# EAGLE design Controller_Keinz_2023 (EAGLE 9.4.2)

## Sheet 1 of 3
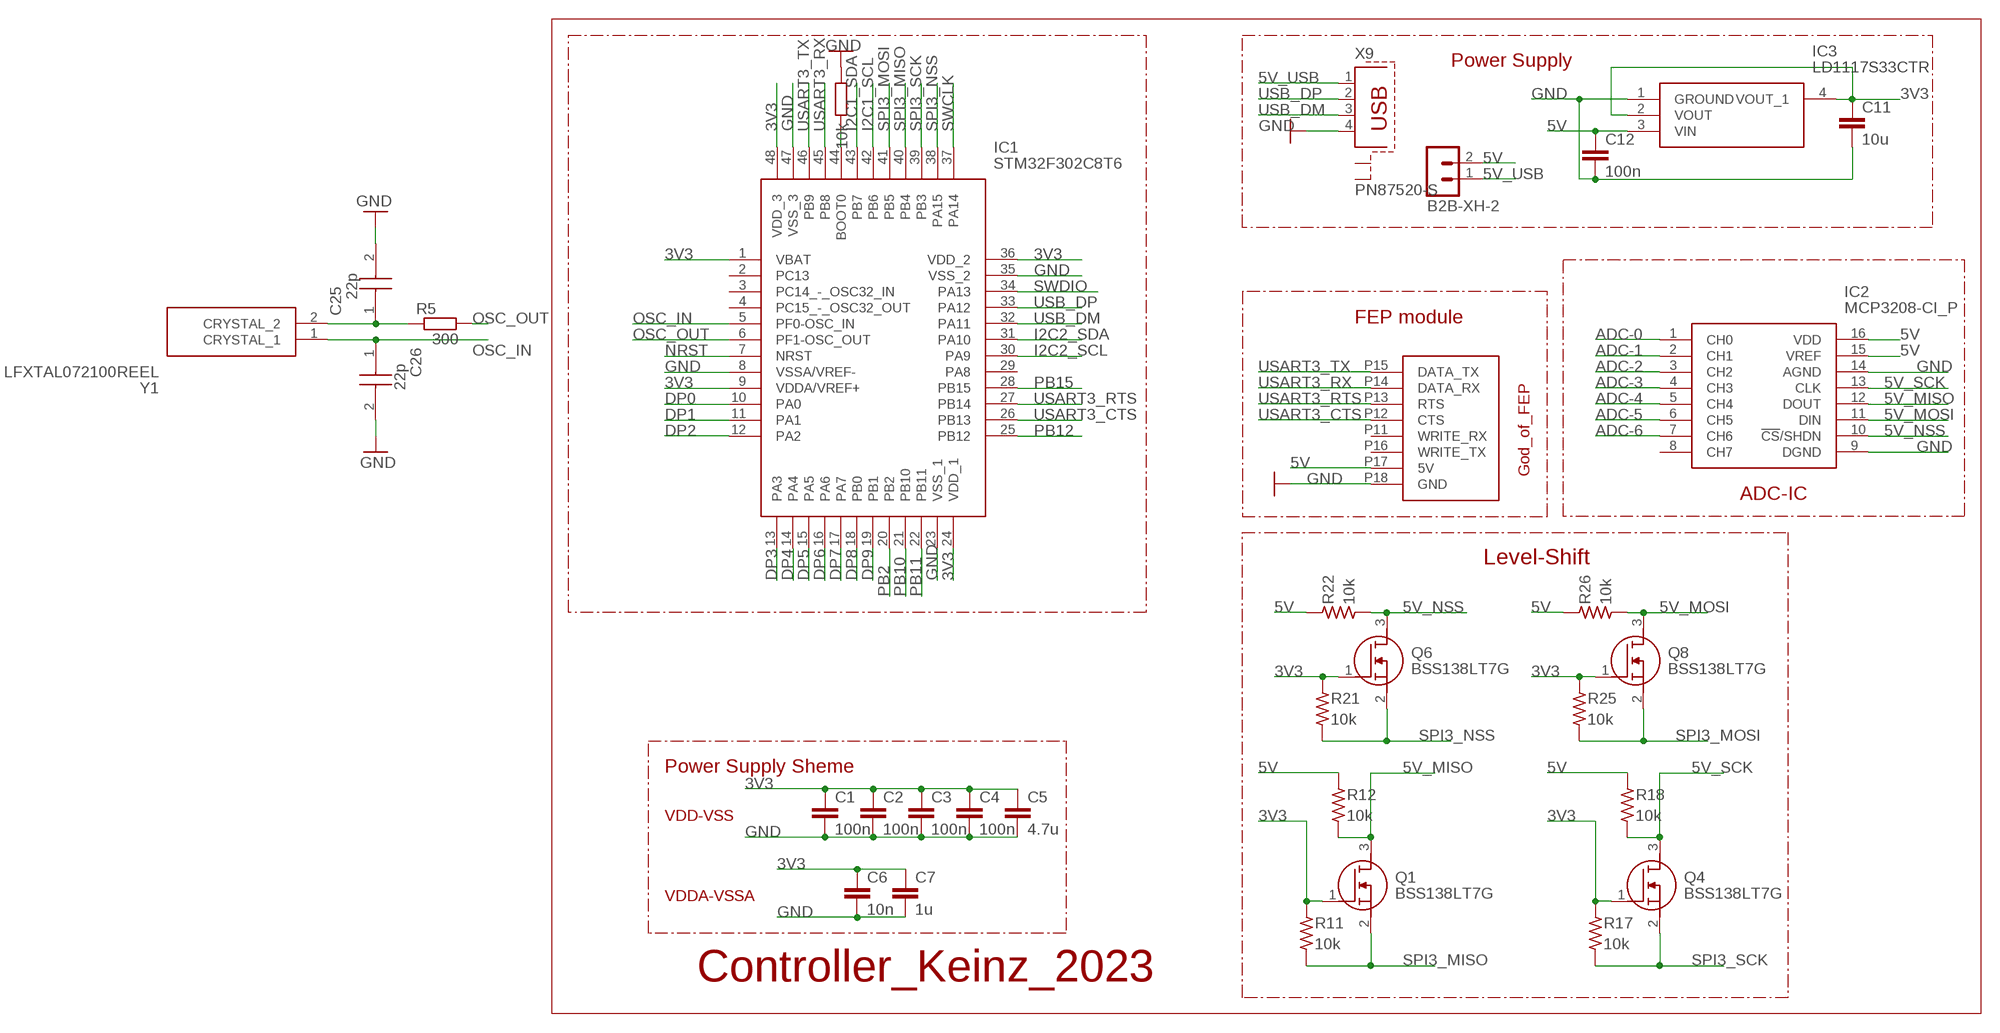
[diagram p0: schematic, sheet 1]

### Parts
C1  100n  C-EUC0603K  [C0603K]
C2  100n  C-EUC0603K  [C0603K]
C3  100n  C-EUC0603K  [C0603K]
C4  100n  C-EUC0603K  [C0603K]
C5  4.7u  C-EUC0603K  [C0603K]
C6  10n  C-EUC0603K  [C0603K]
C7  1u  C-EUC0603K  [C0603K]
C11  10u  C-EUC0603K  [C0603K]
C12  100n  C-EUC0603K  [C0603K]
C25  22p  AMK107BBJ476MA-RE  [CAPC1709X100N]
C26  22p  AMK107BBJ476MA-RE  [CAPC1709X100N]
FEP_1  GOD_OF_FEP  [GOD_OF_FEP]
IC1  STM32F302C8T6  [QFP50P900X900X160-48N]
IC2  MCP3208-CI_P  [DIP781W56P254L1918H533Q16N]
IC3  LD1117S33CTR  [SOT230P700X190-4N]
Q1  BSS138LT7G  [SOT96P237X111-3N]
Q4  BSS138LT7G  [SOT96P237X111-3N]
Q6  BSS138LT7G  [SOT96P237X111-3N]
Q8  BSS138LT7G  [SOT96P237X111-3N]
R5  300  R1608  [1608]
R8  10k  R-EU_R0603  [R0603]
R11  10k  RESISTOR-US1608  [SMD1608]
R12  10k  RESISTOR-US1608  [SMD1608]
R17  10k  RESISTOR-US1608  [SMD1608]
R18  10k  RESISTOR-US1608  [SMD1608]
R21  10k  RESISTOR-US1608  [SMD1608]
R22  10k  RESISTOR-US1608  [SMD1608]
R25  10k  RESISTOR-US1608  [SMD1608]
R26  10k  RESISTOR-US1608  [SMD1608]
X9  PN87520-S  [PN87520-S]
X22  B2B-XH-2  [B2B-XH-A]
Y1  LFXTAL072100REEL  [LFXTAL072100REEL]

### Nets
3V3: C1.1 C2.1 C3.1 C4.1 C5.1 C6.1 C7.1 C11.1 IC1.1(VBAT) IC1.9(VDDA/VREF+) IC1.24(VDD_1) IC1.36(VDD_2) IC1.48(VDD_3) IC3.2(VOUT) IC3.4(VOUT_1) Q1.1(G) Q4.1(G) Q6.1(G) Q8.1(G) R11.1 R17.1 R21.1 R25.1 ; also sheet 2,3
5V: C12.1 FEP_1.P17(5V) IC2.15(VREF) IC2.16(VDD) IC3.3(VIN) R12.1 R18.1 R22.1 R26.1 X22.2 ; also sheet 2,3
5V_MISO: IC2.12(DOUT) Q1.3(D) R12.2
5V_MOSI: IC2.11(DIN) Q8.3(D) R26.2
5V_NSS: IC2.10(!CS!/SHDN) Q6.3(D) R22.2
5V_SCK: IC2.13(CLK) Q4.3(D) R18.2
5V_USB: X9.1 X22.1
ADC-0: IC2.1(CH0) ; also sheet 2
ADC-1: IC2.2(CH1) ; also sheet 2
ADC-2: IC2.3(CH2) ; also sheet 2
ADC-3: IC2.4(CH3) ; also sheet 2
ADC-4: IC2.5(CH4) ; also sheet 2
ADC-5: IC2.6(CH5) ; also sheet 2
ADC-6: IC2.7(CH6) ; also sheet 2
DP0: IC1.10(PA0) ; also sheet 2
DP1: IC1.11(PA1) ; also sheet 2
DP2: IC1.12(PA2) ; also sheet 2
DP3: IC1.13(PA3) ; also sheet 2
DP4: IC1.14(PA4) ; also sheet 2
DP5: IC1.15(PA5) ; also sheet 2
DP6: IC1.16(PA6) ; also sheet 2
DP7: IC1.17(PA7) ; also sheet 2
DP8: IC1.18(PB0) ; also sheet 2
DP9: IC1.19(PB1) ; also sheet 2
GND: C1.2 C2.2 C3.2 C4.2 C5.2 C6.2 C7.2 C11.2 C12.2 C25.2 C26.2 FEP_1.P18(GND) IC1.8(VSSA/VREF-) IC1.23(VSS_1) IC1.35(VSS_2) IC1.47(VSS_3) IC2.9(DGND) IC2.14(AGND) IC3.1(GROUND) R8.1 X9.4 ; also sheet 2,3
I2C1_SCL: IC1.42(PB6) ; also sheet 2
I2C1_SDA: IC1.43(PB7) ; also sheet 2
I2C2_SCL: IC1.30(PA9) ; also sheet 2
I2C2_SDA: IC1.31(PA10) ; also sheet 2
N$20: C25.1 R5.1 Y1.2(CRYSTAL_2)
N$36: IC1.44(BOOT0) R8.2
NRST: IC1.7(NRST) ; also sheet 2
OSC_IN: C26.1 IC1.5(PF0-OSC_IN) Y1.1(CRYSTAL_1)
OSC_OUT: IC1.6(PF1-OSC_OUT) R5.2
PB2: IC1.20(PB2) ; also sheet 3
PB10: IC1.21(PB10) ; also sheet 3
PB11: IC1.22(PB11) ; also sheet 2
PB12: IC1.25(PB12) ; also sheet 3
PB15: IC1.28(PB15) ; also sheet 3
SPI3_MISO: IC1.40(PB4) Q1.2(S) R11.2
SPI3_MOSI: IC1.41(PB5) Q8.2(S) R25.2
SPI3_NSS: IC1.38(PA15) Q6.2(S) R21.2
SPI3_SCK: IC1.39(PB3) Q4.2(S) R17.2
SWCLK: IC1.37(PA14) ; also sheet 2
SWDIO: IC1.34(PA13) ; also sheet 2
USART3_CTS: FEP_1.P12(CTS) IC1.26(PB13)
USART3_RTS: FEP_1.P13(RTS) IC1.27(PB14)
USART3_RX: FEP_1.P14(DATA_RX) IC1.45(PB8)
USART3_TX: FEP_1.P15(DATA_TX) IC1.46(PB9)
USB_DM: IC1.32(PA11) X9.3
USB_DP: IC1.33(PA12) X9.2
Unconnected: FEP_1.P11(WRITE_RX) FEP_1.P16(WRITE_TX) IC1.2(PC13) IC1.3(PC14_-_OSC32_IN) IC1.4(PC15_-_OSC32_OUT) IC1.29(PA8) IC2.8(CH7) X9.S1 X9.S2

### Notes on the sheet
- Power Supply
- FEP module
- ADC-IC
- Level-Shift
- Power Supply Sheme
- VDD-VSS
- VDDA-VSSA
- Controller_Keinz_2023

## Sheet 2 of 3
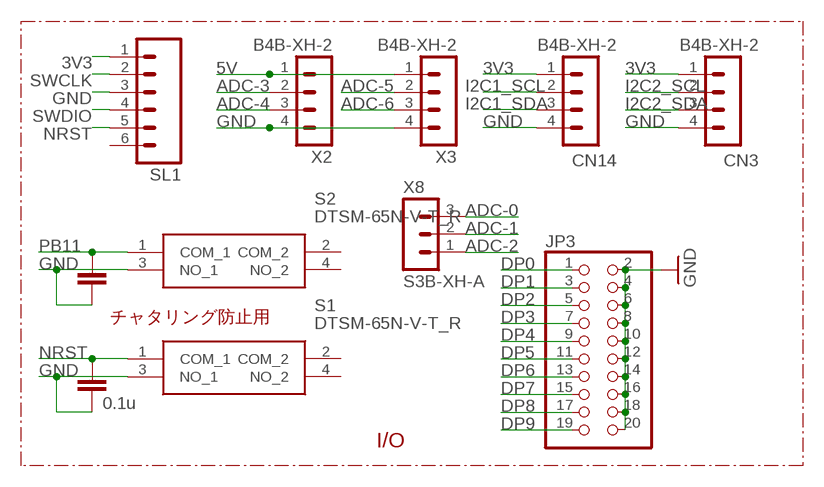
[diagram p1: schematic, sheet 2]

### Parts
C8  0.1u  C-EUC0603K  [C0603K]
C13  0.1u  C-EUC0603K  [C0603K]
CN3  B4B-XH-2  [B4B-XH-A]
CN14  B4B-XH-2  [B4B-XH-A]
JP3  PINHD-2X10  [2X10]
S1  DTSM-65N-V-T_R  [DTSM65NVTR]
S2  DTSM-65N-V-T_R  [DTSM65NVTR]
SL1  MA06  [06PA]
X2  B4B-XH-2  [B4B-XH-A]
X3  B4B-XH-2  [B4B-XH-A]
X8  S3B-XH-A  [S3B-XH-A]

### Nets
3V3: CN3.1 CN14.1 SL1.1 ; also sheet 1,3
5V: X2.1 X3.1 ; also sheet 1,3
ADC-0: X8.3 ; also sheet 1
ADC-1: X8.2 ; also sheet 1
ADC-2: X8.1 ; also sheet 1
ADC-3: X2.2 ; also sheet 1
ADC-4: X2.3 ; also sheet 1
ADC-5: X3.2 ; also sheet 1
ADC-6: X3.3 ; also sheet 1
DP0: JP3.1 ; also sheet 1
DP1: JP3.3 ; also sheet 1
DP2: JP3.5 ; also sheet 1
DP3: JP3.7 ; also sheet 1
DP4: JP3.9 ; also sheet 1
DP5: JP3.11 ; also sheet 1
DP6: JP3.13 ; also sheet 1
DP7: JP3.15 ; also sheet 1
DP8: JP3.17 ; also sheet 1
DP9: JP3.19 ; also sheet 1
GND: C8.2 C13.2 CN3.4 CN14.4 JP3.2 JP3.4 JP3.6 JP3.8 JP3.10 JP3.12 JP3.14 JP3.16 JP3.18 JP3.20 S1.3(NO_1) S2.3(NO_1) SL1.3 X2.4 X3.4 ; also sheet 1,3
I2C1_SCL: CN14.2 ; also sheet 1
I2C1_SDA: CN14.3 ; also sheet 1
I2C2_SCL: CN3.2 ; also sheet 1
I2C2_SDA: CN3.3 ; also sheet 1
NRST: C13.1 S1.1(COM_1) SL1.5 ; also sheet 1
PB11: C8.1 S2.1(COM_1) ; also sheet 1
SWCLK: SL1.2 ; also sheet 1
SWDIO: SL1.4 ; also sheet 1
Unconnected: S1.2(COM_2) S1.4(NO_2) S2.2(COM_2) S2.4(NO_2) SL1.6

### Notes on the sheet
- チャタリング防止用
- I/O

## Sheet 3 of 3
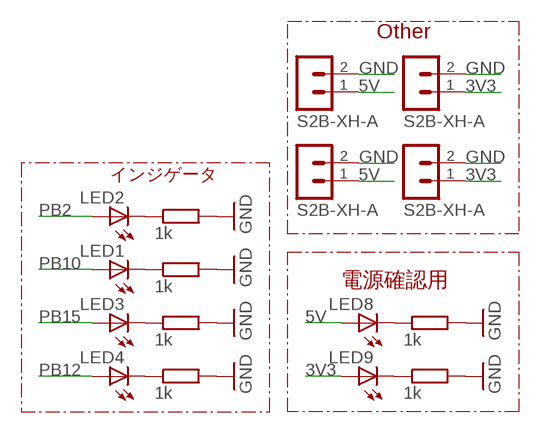
[diagram p2: schematic, sheet 3]

### Parts
LED1  LEDCHIP-LED0805  [CHIP-LED0805]
LED2  LEDCHIP-LED0805  [CHIP-LED0805]
LED3  LEDCHIP-LED0805  [CHIP-LED0805]
LED4  LEDCHIP-LED0805  [CHIP-LED0805]
LED8  LEDCHIP-LED0805  [CHIP-LED0805]
LED9  LEDCHIP-LED0805  [CHIP-LED0805]
R1  1k  R-EU_R0603  [R0603]
R2  1k  R-EU_R0603  [R0603]
R3  1k  R-EU_R0603  [R0603]
R4  1k  R-EU_R0603  [R0603]
R9  1k  R-EU_R0603  [R0603]
R10  1k  R-EU_R0603  [R0603]
X4  S2B-XH-A  [S2B-XH-A]
X5  S2B-XH-A  [S2B-XH-A]
X6  S2B-XH-A  [S2B-XH-A]
X7  S2B-XH-A  [S2B-XH-A]

### Nets
3V3: LED9.A X4.1 X5.1 ; also sheet 1,2
5V: LED8.A X6.1 X7.1 ; also sheet 1,2
GND: R1.2 R2.2 R3.2 R4.2 R9.2 R10.2 X4.2 X5.2 X6.2 X7.2 ; also sheet 1,2
N$1: LED2.C R1.1
N$2: LED1.C R2.1
N$3: LED3.C R3.1
N$4: LED4.C R4.1
N$9: LED9.C R10.1
N$10: LED8.C R9.1
PB2: LED2.A ; also sheet 1
PB10: LED1.A ; also sheet 1
PB12: LED4.A ; also sheet 1
PB15: LED3.A ; also sheet 1

### Notes on the sheet
- Other
- インジゲータ
- 電源確認用

## Library data of the parts
C1-C8 C11-C13 = rcl:C-EU: CAPACITOR, European symbol
C25 C26 = SamacSys_Parts:AMK107BBJ476MA-RE: 0603 (1608M) 47uF MLCC 4V dc +/-20% SMD Source: Datasheet <https://ds.yuden.co.jp/TYCOMPAS/ut/detail?pn=AMK107BBJ476MA-RE&u=M>; DESCRIPTION: 0603 (1608M) 47uF MLCC 4V dc +/-20% SMD; HEIGHT: 1mm; MANUFACTURER_NAME: TAIYO YUDEN; MANUFACTURER_PART_NUMBER: AMK107BBJ476MA-RE; MOUSER_PART_NUMBER: 963-AMK107BBJ476MARE; MOUSER_PRICE-STOCK: https://www.mouser.com/Search/Refine.aspx?Keyword=963-AMK107BBJ476MARE; RS_PART_NUMBER: 1843762P; RS_PRICE-STOCK: http://uk.rs-online.com/web/p/products/1843762P
CN3 CN14 X2 X3 = JST-XH:B4B-XH: JST XH series header 2.50mm pitch disconnectable crimp style connectors, vertical (side entry type), 4 pins
FEP_1 = God_of_FEP:GOD_OF_FEP
IC1 = SamacSys_Parts:STM32F302C8T6: STMICROELECTRONICS - STM32F302C8T6 - MCU, 32BIT, CORTEX-M4, 72MHZ, LQFP-48 Source: Datasheet <http://www.st.com/content/ccc/resource/technical/document/datasheet/e4/06/d5/04/58/af/41/14/DM00093333.pdf/files/DM00093333.pdf/jcr:content/translations/en.DM00093333.pdf>; ARROW_PART_NUMBER: STM32F302C8T6; ARROW_PRICE-STOCK: https://www.arrow.com/en/products/stm32f302c8t6/stmicroelectronics; DESCRIPTION: STMICROELECTRONICS - STM32F302C8T6 - MCU, 32BIT, CORTEX-M4, 72MHZ, LQFP-48; HEIGHT: 1.6mm; MANUFACTURER_NAME: STMicroelectronics; MANUFACTURER_PART_NUMBER: STM32F302C8T6; MOUSER_PART_NUMBER: 511-STM32F302C8T6; MOUSER_PRICE-STOCK: https://www.mouser.co.uk/ProductDetail/STMicroelectronics/STM32F302C8T6?qs=F5OEftmZcCDUtHR76ET77A%3D%3D
IC2 = SamacSys_Parts:MCP3208-CI_P: A/D Converters Source: Datasheet <https://eu.mouser.com/datasheet/2/268/21298e-1101808.pdf>; ARROW_PART_NUMBER: MCP3208-CI/P; ARROW_PRICE-STOCK: https://www.arrow.com/en/products/mcp3208-cip/microchip-technology?region=europe; DESCRIPTION: A/D Converters; HEIGHT: 5.334mm; MANUFACTURER_NAME: Microchip; MANUFACTURER_PART_NUMBER: MCP3208-CI/P; MOUSER_PART_NUMBER: 579-MCP3208CIP; MOUSER_PRICE-STOCK: https://www.mouser.co.uk/ProductDetail/Microchip-Technology/MCP3208-CI-P?qs=9y3LFqDLL8IuAGJEebQX9g%3D%3D
IC3 = SamacSys_Parts:LD1117S33CTR: LD1117S33CTR, Low Dropout Voltage Regulator, 1.3A, 3.3 V +/-1%, 4-Pin SOT-223 Source: Datasheet <http://www.st.com/st-web-ui/static/active/en/resource/technical/document/datasheet/CD00000544.pdf>; ALLIED_NUMBER: 70390200; ALLIED_PRICE-STOCK: http://www.alliedelec.com/stmicroelectronics-ld1117s33ctr/70390200/; DESCRIPTION: LD1117S33CTR, Low Dropout Voltage Regulator, 1.3A, 3.3 V +/-1%, 4-Pin SOT-223; HEIGHT: 1.9mm; MANUFACTURER_NAME: STMicroelectronics; MANUFACTURER_PART_NUMBER: LD1117S33CTR; MOUSER_PART_NUMBER: 511-LD1117S33C; MOUSER_PRICE-STOCK: https://www.mouser.com/Search/Refine.aspx?Keyword=511-LD1117S33C; RS_PART_NUMBER: 6869388P; RS_PRICE-STOCK: http://uk.rs-online.com/web/p/products/6869388P
JP3 = pinhead:PINHD-2X10: PIN HEADER
LED1-LED4 LED8 LED9 = adafruit:LED: LED OSRAM: - CHIPLED LG R971, LG N971, LY N971, LG Q971, LY Q971, LO R971, LY R971 LH N974, LH R974 LS Q976, LO Q976, LY Q976 LO Q996 - Hyper CHIPLED LW Q18S LB Q993, LB Q99A, LB R99A - SideLED LS A670, LO A670, LY A670, LG A670, LP A670 LB A673, LV A673, LT A673, LW A673 LH A674 LY A675 LS A676, LA A676, LO A676, LY A676, LW A676 LS A679, LY A679, LG A679 - Hyper Micro SIDELED® LS Y876, LA Y876, LO Y876, LY Y876 LT Y87S - SmartLED LW L88C, LW L88S LB L89C, LB L89S, LG L890 LS L89K, LO L89K, LY L89K LS L896, LA L896, LO L896, LY L896 - TOPLED LS T670, LO T670, LY T670, LG T670, LP T670 LSG T670, LSP T670, LSY T670, LOP T670, LYG T670 LG T671, LOG T671, LSG T671 LB T673, LV T673, LT T673, LW T673 LH T674 LS T676, LA T676, LO T676, LY T676, LB T676, LH T676, LSB T676, LW T676 LB T67C, LV T67C, LT T67C, LS T67K, LO T67K, LY T67K, LW E67C LS E67B, LA E67B, LO E67B, LY E67B, LB E67C, LV E67C, LT E67C LW T67C LS T679, LY T679, LG T679 LS T770, LO T770, LY T770, LG T770, LP T770 LB T773, LV T773, LT T773, LW T773 LH T774 LS E675, LA E675, LY E675, LS T675 LS T776, LA T776, LO T776, LY T776, LB T776 LHGB T686 LT T68C, LB T68C - Hyper Mini TOPLED® LB M676 - Mini TOPLED Santana® LG M470 LS M47K, LO M47K, LY M47K Source: http://www.osram.convergy.de/
Q1 Q4 Q6 Q8 = SamacSys_Parts:BSS138LT7G: MOSFET Single N-Channel Logic Level Power MOSFET 50V, 200mA, 3.5 Source: Datasheet <https://www.mouser.com/datasheet/2/308/BSS138LT1-D-1522521.pdf>; ARROW_PART_NUMBER: BSS138LT7G; ARROW_PRICE-STOCK: https://www.arrow.com/en/products/bss138lt7g/on-semiconductor; DESCRIPTION: MOSFET Single N-Channel Logic Level Power MOSFET 50V, 200mA, 3.5; HEIGHT: 1.11mm; MANUFACTURER_NAME: ON Semiconductor; MANUFACTURER_PART_NUMBER: BSS138LT7G; MOUSER_PART_NUMBER: 863-BSS138LT7G; MOUSER_PRICE-STOCK: https://www.mouser.co.uk/ProductDetail/ON-Semiconductor/BSS138LT7G/?qs=l7cgNqFNU1gVGpXKtqpwiw%3D%3D
R1-R4 R8-R10 = rcl:R-EU_: RESISTOR, European symbol; SPICEPREFIX: R
R5 = 1608:R1608
R11 R12 R17 R18 R21 R22 R25 R26 = generic:RESISTOR-US: Generic Registor
S1 S2 = SamacSys_Parts:DTSM-65N-V-T_R: Tactile Switches Surface Mounting Type 6*6 Source: Datasheet <https://componentsearchengine.com/Datasheets/1/DTSM-65N-V-T_R.pdf>; DESCRIPTION: Tactile Switches Surface Mounting Type 6*6; HEIGHT: 9.6mm; MANUFACTURER_NAME: Diptronics; MANUFACTURER_PART_NUMBER: DTSM-65N-V-T/R; MOUSER_PART_NUMBER: 113-DTSM-65N-V-T/R; MOUSER_PRICE-STOCK: https://www.mouser.com/Search/Refine.aspx?Keyword=113-DTSM-65N-V-T%2FR
SL1 = con-amp-quick:MA06: AMP QUICK CONNECTOR; OC_FARNELL: unknown; OC_NEWARK: unknown
X4-X7 = con-JST_XH:S2B-XH: JST XH series header 2.50mm pitch disconnectable crimp style connectors, horizontal (side entry type), 2 pins
X8 = con-JST_XH:S3B-XH: JST XH series header 2.50mm pitch disconnectable crimp style connectors, horizontal (side entry type), 3 pins
X9 = con-berg_improved_by_keinz:PN87520-S; OC_FARNELL: unknown; OC_NEWARK: unknown
X22 = con-JST_XH:B2B-XH: JST XH series header 2.50mm pitch disconnectable crimp style connectors, vertical (side entry type), 2 pins
Y1 = SamacSys_Parts:LFXTAL072100REEL: Industry standard SMD crystal/ HC49/4HSMX Source: Datasheet <https://www.mouser.de/datasheet/2/741/LFXTAL072100Reel-1001673.pdf>; DESCRIPTION: Industry standard SMD crystal/ HC49/4HSMX; HEIGHT: 4.3mm; MANUFACTURER_NAME: IQD; MANUFACTURER_PART_NUMBER: LFXTAL072100REEL

## Board
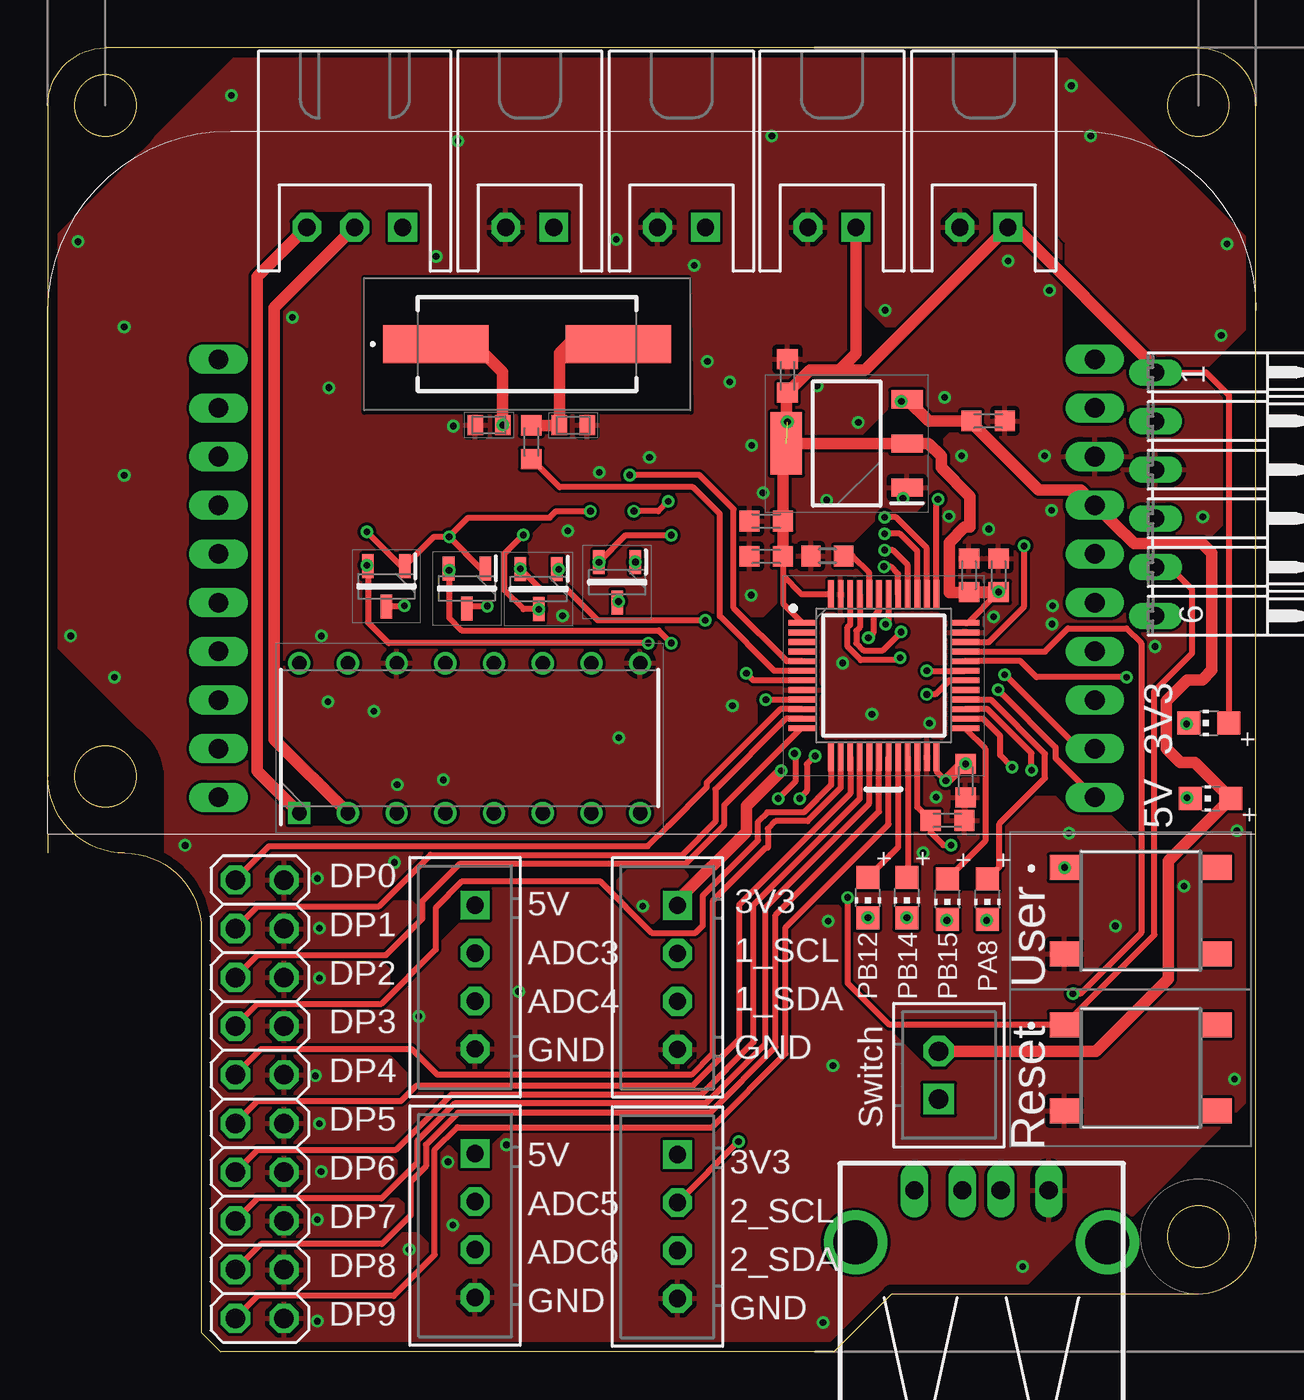
[diagram p3: board, top side]
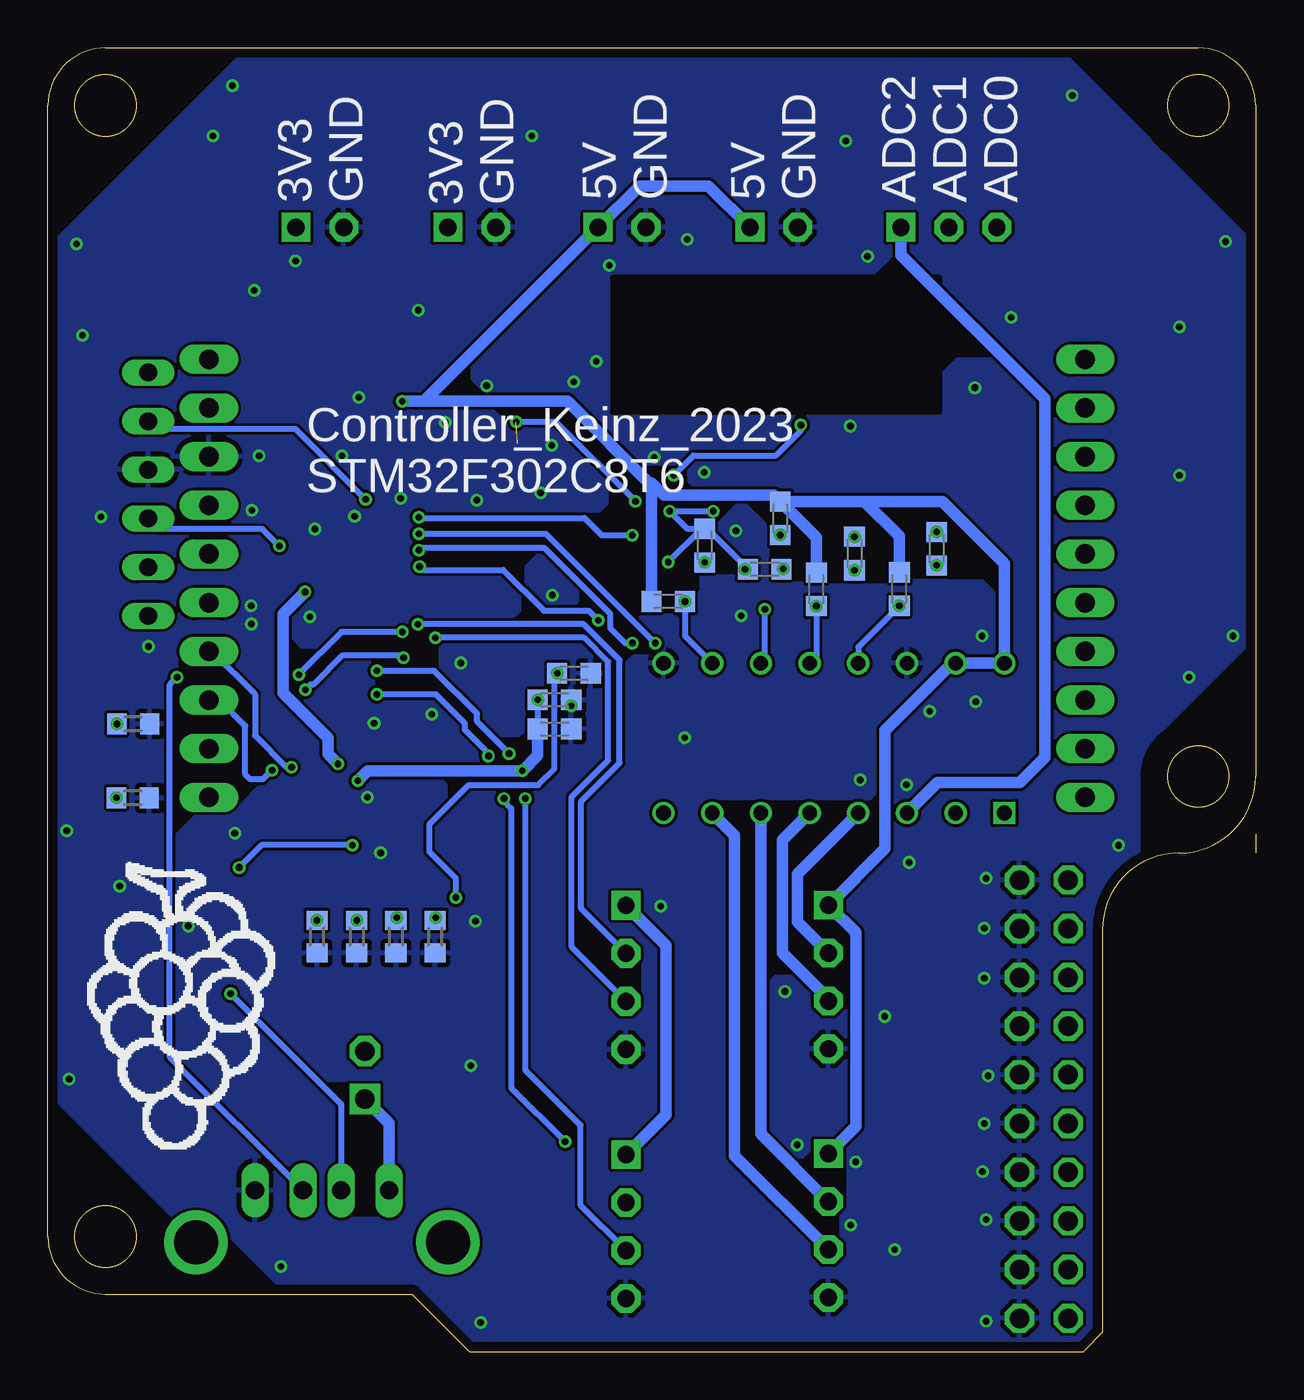
[diagram p4: board, bottom side, seen from below]

Size 63 x 68 mm. Coordinates in mm from the lower left corner, seen from the top.
Outline: 0,27 0,26
Outline: 63,6 63,65 arc90 60,68 3,68 arc90 0,65 0,30 arc90 4,26 arc-90 8,22 8,1 9,0 41,0 44,3 60,3 arc90 63,6
Outline: circle at 3,65 radius 1.6
Outline: circle at 60,65 radius 1.6
Outline: circle at 3,30 radius 1.6
Outline: circle at 60,6 radius 1.6
Copper layers (1*16): Top 0.035mm / dielectric 1.6mm / Bottom 0.035mm
Design rules "Elecrow_2-layer_PCB_eagle_rule": minimum track width 6mil, minimum drill 12mil, track to track 6mil, track to pad 6mil, pad to pad 6mil, via to via 8mil, smd to smd 0mil, copper to edge 20mil, drill to drill 10mil, minimum pad ring 6mil, minimum via ring 6mil, stop-mask expansion 0mil, vias tented up to drill 100mil, thermal gap 10mil
tRestrict: area 0,62 to 6,68; area 0,27 to 6,33; area 57,62 to 63,68; area 57,3 to 63,9; 78 lines
bRestrict: area 0,62 to 6,68; area 0,27 to 6,33; area 57,62 to 63,68; area 57,3 to 63,9; 79 lines
vRestrict: 1 lines

### Footprints (pad centres in the part's own frame; a part is rotated, then mirrored left to right if it is on the bottom)
C0603K = smd 1.05 x 1.08: 1 -0.875,0; 2 0.875,0
CAPC1709X100N = smd 0.81 x 1.04: 1 -0.72,0; 2 0.72,0
B4B-XH-A = drill 0.9 pad 1.5 square: 1 3.75,0 | drill 0.9 pad 1.5 octagon: 2 1.25,0; 3 -1.25,0; 4 -3.75,0
GOD_OF_FEP = drill 1.02 long: P1 8.89,9.525; P2 8.89,6.985; P3 8.89,4.445; P4 8.89,1.905; P5 8.89,14.605; P6 8.89,17.145; P7 8.89,19.685; P8 8.89,22.225; P9 8.89,24.765; P10 8.89,12.065; P11 54.61,12.065; P12 54.61,9.525; P13 54.61,6.985; P14 54.61,4.445; P15 54.61,1.905; P16 54.61,14.605; P17 54.61,17.145; P18 54.61,19.685; P19 54.61,22.225; P20 54.61,24.765
QFP50P900X900X160-48N = smd 1.475 x 0.3: 1 -4.238,2.75; 2 -4.238,2.25; 3 -4.238,1.75; 4 -4.238,1.25; 5 -4.238,0.75; 6 -4.238,0.25; 7 -4.238,-0.25; 8 -4.238,-0.75; 9 -4.238,-1.25; 10 -4.238,-1.75; 11 -4.238,-2.25; 12 -4.238,-2.75; 25 4.238,-2.75; 26 4.238,-2.25; 27 4.238,-1.75; 28 4.238,-1.25; 29 4.238,-0.75; 30 4.238,-0.25; 31 4.238,0.25; 32 4.238,0.75; 33 4.238,1.25; 34 4.238,1.75; 35 4.238,2.25; 36 4.238,2.75 | smd 0.3 x 1.475: 13 -2.75,-4.238; 14 -2.25,-4.238; 15 -1.75,-4.238; 16 -1.25,-4.238; 17 -0.75,-4.238; 18 -0.25,-4.238; 19 0.25,-4.238; 20 0.75,-4.238; 21 1.25,-4.238; 22 1.75,-4.238; 23 2.25,-4.238; 24 2.75,-4.238; 37 2.75,4.238; 38 2.25,4.238; 39 1.75,4.238; 40 1.25,4.238; 41 0.75,4.238; 42 0.25,4.238; 43 -0.25,4.238; 44 -0.75,4.238; 45 -1.25,4.238; 46 -1.75,4.238; 47 -2.25,4.238; 48 -2.75,4.238
DIP781W56P254L1918H533Q16N = drill 0.759 pad 1.159 square: 1 -3.905,8.89 | drill 0.759 pad 1.159: 2 -3.905,6.35; 3 -3.905,3.81; 4 -3.905,1.27; 5 -3.905,-1.27; 6 -3.905,-3.81; 7 -3.905,-6.35; 8 -3.905,-8.89; 9 3.905,-8.89; 10 3.905,-6.35; 11 3.905,-3.81; 12 3.905,-1.27; 13 3.905,1.27; 14 3.905,3.81; 15 3.905,6.35; 16 3.905,8.89
SOT230P700X190-4N = smd 1.65 x 0.95: 1 -3.15,2.3; 2 -3.15,0; 3 -3.15,-2.3 | smd 1.65 x 3.25: 4 3.15,0
2X10 = drill 1.016 octagon: 1 -11.43,-1.27; 2 -11.43,1.27; 3 -8.89,-1.27; 4 -8.89,1.27; 5 -6.35,-1.27; 6 -6.35,1.27; 7 -3.81,-1.27; 8 -3.81,1.27; 9 -1.27,-1.27; 10 -1.27,1.27; 11 1.27,-1.27; 12 1.27,1.27; 13 3.81,-1.27; 14 3.81,1.27; 15 6.35,-1.27; 16 6.35,1.27; 17 8.89,-1.27; 18 8.89,1.27; 19 11.43,-1.27; 20 11.43,1.27
CHIP-LED0805 = smd 1.2 x 1.2: A 0,-1.05; C 0,1.05
SOT96P237X111-3N = smd 1.25 x 0.6: 1 -1.05,0.955; 2 -1.05,-0.955; 3 1.05,0
R0603 = smd 1 x 1.1: 1 -0.85,0; 2 0.85,0
1608 = smd 1.05 x 1.08: 1 -0.875,0; 2 0.875,0
SMD1608 = smd 1.05 x 1.08: 1 -0.875,0; 2 0.875,0
DTSM65NVTR = smd 1.55 x 1.3: 1 -3.975,2.25; 2 3.975,2.25; 3 -3.975,-2.25; 4 3.975,-2.25
06PA = drill 0.914 long: 1 -6.35,0; 2 -3.81,0; 3 -1.27,0; 4 1.27,0; 5 3.81,0; 6 6.35,0
S2B-XH-A = drill 0.9 pad 1.5 square: 1 1.25,0 | drill 0.9 pad 1.5 octagon: 2 -1.25,0
S3B-XH-A = drill 0.9 pad 1.5 square: 1 2.5,0 | drill 0.9 pad 1.5 octagon: 2 0,0; 3 -2.5,0
PN87520-S = drill 0.95 long: 1 -3.5,2.71; 2 -1,2.71; 3 1,2.71; 4 3.5,2.71 | drill 2.3 pad 2.9: S1 -6.57,0; S2 6.57,0
B2B-XH-A = drill 1 pad 1.6 square: 1 1.25,0 | drill 1 pad 1.6 octagon: 2 -1.25,0
LFXTAL072100REEL = smd 5.5 x 2: 1 -4.75,0; 2 4.75,0

### Placement (x,y rotation side)
C1  48.05,40.5 90 top
C2  49.59,40.5 90 top
C3  37.47,41.48 180 top
C4  37.47,43.32 180 top
C5  47.87,29.78 270 top
C6  36.58,33.99 0 bottom
C7  36.58,32.47 0 bottom
C8  46.92,27.71 0 top
C11  38.58,50.89 90 top
C12  49.04,48.54 0 top
C13  35.56,35.38 0 bottom
C25  27.4,48.32 0 top
C26  23.01,48.33 180 top
CN3  32.84,6.52 90 top
CN14  32.84,19.52 90 top
FEP_1  0,27 0 top
IC1  43.6,35.26 0 top
IC2  22,32 90 top
IC3  41.66,47.37 180 top
JP3  11.05,13.17 270 top
LED1  44.8,23.68 180 top
LED2  42.77,23.68 180 top
LED3  49.01,23.6 180 top
LED4  46.92,23.6 180 top
LED8  60.65,28.84 90 top
LED9  60.55,32.78 90 top
Q1  21.85,39.8 270 top
Q4  17.66,39.91 270 top
Q6  29.69,40.13 270 top
Q8  25.6,39.77 270 top
R1  42.8,21.64 270 bottom
R2  44.85,21.64 270 bottom
R3  48.97,21.64 270 bottom
R4  46.89,21.64 270 bottom
R5  25.22,47.44 270 top
R8  40.66,41.5 0 top
R9  58.57,28.88 0 bottom
R10  58.55,32.74 0 bottom
R11  20.93,41.63 270 bottom
R12  22.91,39.76 270 bottom
R17  16.64,41.88 270 bottom
R18  18.59,39.77 270 bottom
R21  28.75,42.04 270 bottom
R22  30.64,39.13 0 bottom
R25  25.61,40.81 0 bottom
R26  24.8,43.47 270 bottom
S1  57,14.8 0 top
S2  57,23 0 top
SL1  57.77,44.72 270 top
X2  22.29,19.53 90 top
X3  22.29,6.57 90 top
X4  40.89,58.64 0 top
X5  48.82,58.64 0 top
X6  25.13,58.64 0 top
X7  33.05,58.64 0 top
X8  16,58.64 0 top
X9  48.7,5.7 0 top
X22  46.47,14.42 270 top
Y1  24.99,52.55 0 top

### Tracks (layer width: path | path; a pad name or v marks a point on that pad's centre or on a via)
3V3  (via drill 0.35)  (1 unrouted)
  Top 0.305: C3.1 38.34,40.47 | 38.34,40.47 38.34,39.03 IC1.1 | IC1.48 39.31,39.5 38.34,40.47 | C2.1 47.98,38.01 IC1.36 | v32.35,44.35 31.84,43.84 v30.57,43.84 | Q8.1 26.63,40.82 v26.64,40.81 | SL1.1 60.42,51.07 61.6,49.89 LED9.A | Q1.1 22.58,40.85 R11.1 | v28.3,43.84 26.51,43.84 26.17,43.5 25.79,43.5 25.78,43.5 21.92,43.5 R11.1 | R17.1 18.43,40.96 Q4.1 20.15,42.5 R11.1 | IC1.24 46.35,30.26 v46.84,29.77 | IC1.9 39.34,33.99 C6.1
  Top 0.61: C1.1 C2.1 49.56,39.6 47.01,39.6 47.01,42.21 47.8,43 48.1,43 48.1,44.6 46.6,46.1 46.6,46.7 45.93,47.37 IC3.2 IC3.4 | C3.1 C4.1 38.34,47.2 IC3.4 | 41.28,51.2 39.76,51.2 C11.1 38.52,49.95 IC3.4 | 41.28,51.2 42.62,51.2 X5.1 50.45,58.64 57.77,51.33 SL1.1 | CN14.1 32.84,23.52 36.43,27.11 36.43,28.47 v38.25,30.29 | 41.28,51.2 42.14,52.06 X4.1 | v46.84,29.77 47.72,30.65 C5.1
  Bottom 0.305: C6.1 C7.1 | R21.1 28.91,42.92 Q6.1 | R21.1 29.65,42.92 v30.57,43.84 v28.3,43.84 | R21.1 28.62,42.79 28.46,42.79 R25.1 v26.64,40.81 | v32.35,44.35 36.49,48.49 v38.58,48.49
  Bottom 0.61: v46.84,29.77 46.33,30.28 38.26,30.28 v38.25,30.29 37.45,31.09 C7.1 | CN3.1 30.77,12.34 30.77,21.19 CN14.1 | C5.1 48.38,31.16 48.38,31.99 50.73,34.35 50.73,38.48 C2.1
  other vias: 30.65,41.18 20.93,42.5 16.64,42.76 47.87,30.65 49.59,39.62 37.45,33.99
5V  (via drill 0.35)
  Top 0.61: v44.52,49.57 44.72,49.57 IC3.3 45.94,48.54 C12.1 48.17,48.47 51.7,44.94 53.88,44.94 FEP_1.P17 56.68,42.14 60.21,42.14 60.71,41.64 60.71,35.55 60.2,35.04 59.43,35.04 58.33,33.94 58.33,31.45 59.05,30.72 59.83,30.72 LED8.A 58.45,25.59 58.45,19.45 54.67,15.67 X22.2
  Bottom 0.61: X3.1 20.86,11.75 20.86,21.86 X2.1 19.34,26.23 19.34,32.38 15.82,35.91 IC2.15 IC2.16 13.11,41.11 16.34,44.34 20.4,44.34 | 31.52,45.18 35.9,49.57 v44.52,49.57 43.38,49.57 X7.1 32.14,60.8 28.54,60.8 X6.1 | 31.52,45.18 31.52,45.31 30.87,44.66 25.12,44.66 R26.1 | 31.52,45.18 R22.1 | R12.1 22.91,42.46 R26.1 | 20.4,44.34 R26.1 | R18.1 18.59,42.53 20.4,44.34
5V_MISO  (via drill 0.35)
  Top 0.305: Q1.3 21.99,38.89 R12.2
  Bottom 0.305: R12.2 22.91,36.26 IC2.12
  other vias: 22.91,38.89
5V_MOSI  (via drill 0.35)
  Top 0.305: Q8.3 24.81,38.72 23.8,39.73 23.8,41.6 24.79,42.59 R26.2
  Bottom 0.305: Q8.3 25.6,36.12 IC2.11
  other vias: 25.6,38.72 24.8,42.59
5V_NSS  (via drill 0.35)
  Top 0.305: Q6.3 29.74,39.13 R22.2
  Bottom 0.305: R22.2 29.77,37.32 IC2.10
  other vias: 29.77,39.13
5V_SCK  (via drill 0.35)
  Top 0.305: Q4.3 17.69,38.9 R18.2
  Bottom 0.305: R18.2 20.73,36.76 IC2.13
  other vias: 18.59,38.9
5V_USB
  Bottom 0.61: X9.1 45.2,11.9 X22.1
ADC-0
  Top 0.61: IC2.1 10.92,30.28 10.92,56.06 X8.3
ADC-1
  Top 0.61: IC2.2 11.81,31.93 11.81,54.45 X8.2
ADC-2
  Bottom 0.61: IC2.3 16.59,29.69 12.31,29.69 11,31 11,49.7 18.5,57.2 X8.1
ADC-3
  Bottom 0.61: X2.2 23.91,22.41 23.91,24.91 IC2.4
ADC-4
  Bottom 0.61: X2.3 22.29,18.4 24.68,20.79 24.68,26.69 IC2.5
ADC-5
  Bottom 0.61: IC2.6 25.81,11.35 X3.2
ADC-6
  Bottom 0.61: IC2.7 27.18,26.92 27.18,10.22 X3.3
DP0
  Top 0.305: JP3.1 11.55,26.37 31.3,26.37 32.36,27.43 34.36,29.43 34.36,29.66 38.21,33.51 IC1.10
DP1
  Top 0.305: JP3.3 10.95,23.23 17.27,23.23 19.96,25.91 33.09,25.91 34.82,27.64 34.82,29.32 38.51,33.01 IC1.11
DP2
  Top 0.305: JP3.5 10.95,20.69 17.63,20.69 19.54,22.59 19.54,23.5 21.5,25.46 33.28,25.46 35.27,27.45 35.27,28.5 39.29,32.51 IC1.12
DP3
  Top 0.305: JP3.7 10.95,18.15 17.4,18.15 20.22,20.97 20.22,23.15 21.58,24.51 28.83,24.51 31.5,21.84 33.78,21.84 34.16,22.23 34.16,23.79 37.04,26.67 37.04,27.65 37.53,28.13 39.43,28.13 40.85,29.55 IC1.13
DP4
  Top 0.305: JP3.9 11.12,15.78 18.97,15.78 20.32,14.44 33.56,14.44 34.67,15.54 34.67,23.5 37.47,26.29 37.55,26.29 37.55,27.26 37.96,27.67 39.62,27.67 41.35,29.4 IC1.14
DP5
  Top 0.305: JP3.11 10.95,13.07 18.41,13.07 19.2,13.85 33.63,13.85 36.05,16.27 36.05,23.3 41.85,29.1 IC1.15
DP6
  Top 0.305: JP3.13 10.95,10.53 18.16,10.53 21.03,13.4 34.06,13.4 36.81,16.15 36.81,23.31 42.35,28.85 IC1.16
DP7
  Top 0.305: JP3.15 10.95,7.99 17.4,7.99 19.27,9.85 19.27,10.98 21.22,12.94 34.25,12.94 34.3,12.99 34.37,12.99 37.42,16.05 37.42,23.17 42.85,28.59 IC1.17
DP8
  Top 0.305: JP3.17 11.12,5.62 17.43,5.62 18.92,7.11 18.92,8.86 19.72,9.66 19.72,10.79 21.39,12.46 34.53,12.46 37.96,15.89 37.96,22.77 43.35,28.16 IC1.18
DP9
  Top 0.305: JP3.19 10.95,2.91 18.03,2.91 20.18,5.05 20.18,10.53 21.36,11.71 34.65,11.71 38.48,15.54 38.48,22.13 43.85,27.5 IC1.19
GND  (via drill 0.35)
  other vias: 37.3,44.8 34.4,51.65 29.65,58.01 14.27,37.33 24.55,18.78 45.98,32.77 31.03,23.23 40.95,14.92 53.26,27.04 47,43.57 47.67,46.72 35.57,50.58 26.84,38.38 18.84,5.32 21.12,6.59 23.92,10.78 3.98,53.45 3.98,45.71 3.47,35.17 21.38,63.15 37.76,63.41 54.4,63.41 60.24,43.55 44.6,44.5 17,33.4 14.6,33.9 61.2,53 29.78,32.02 14.05,24.68 14.15,22.08 14.15,19.48 19.35,17.48 13.95,14.38 14.15,11.88 14.25,9.38 14.05,6.88 14.05,1.58 59.26,24.28 57.76,36.78 52.4,38.91 52.36,43.88 52.38,37.95 35.71,33.69 27.11,42.81 28.76,45.86 21.14,48.27 33.72,56.66 31.38,46.64 36.71,47.27 40.12,50.38 43.67,54.32 42.27,48.48 40.62,44.41 36.69,39.46 46.34,28.92 49.33,38.33 49.08,42.9 41.46,35.92 42.98,33.25 45.65,26.01 40.7,22.45 55.68,22.2 18.22,29.57 20.63,29.82 12.76,53.95 20.25,57.13 9.57,65.52 1.57,57.9 1.19,37.33 7.16,26.4 53.38,66.03 61.51,57.77 62.02,27.17 61.89,14.21 50.84,4.43 40.43,1.51 20.87,9.89 18.08,25.52 14.65,50.28 50.08,56.88 52.24,55.36 51.99,46.72 46.78,49.77
  pour Top: 0,68.54 64,68.54 64,0 0,0
  pour Bottom: -1,69.44 65,69.44 65,-1 -1,-1
I2C1_SCL  (via drill 0.35)
  Top 0.305: IC1.42 43.85,37.94 v43.7,37.94
  Bottom 0.305: v43.7,37.94 35.05,37.94 33.18,36.07 33.18,30.71 35.18,28.71 35.18,23.11 CN14.2
I2C1_SDA  (via drill 0.35)
  Top 0.305: IC1.43 43.35,38.64 43.05,38.35 43.05,37.49 v42.8,37.23
  Bottom 0.305: v42.8,37.23 35.05,37.23 33.78,35.97 33.78,30.84 35.69,28.94 35.69,21.11 CN14.3
I2C2_SCL  (via drill 0.35)
  Top 0.305: CN3.2 v36.02,10.95 | IC1.30 47.02,35.01 46.28,34.28 v45.85,34.28 | v39.21,28.85 39.59,29.23 39.59,30.64 v40.02,31.07
  Bottom 0.305: v40.02,31.07 40.02,31.2 41.25,32.43 41.25,32.77 42.76,34.28 v45.85,34.28 | v39.21,28.85 39.21,28.72 38.83,28.34 38.83,13.76 v36.02,10.95
I2C2_SDA  (via drill 0.35)
  Top 0.305: v38.95,31.2 38.99,31.15 38.99,29.74 v38.1,28.85 | v45.85,35.51 IC1.31
  Bottom 0.305: v38.95,31.2 40.61,32.86 40.61,33.27 42.85,35.51 v45.85,35.51 | v38.1,28.85 38.1,14.7 35.21,11.81 35.21,7.64 CN3.3
N$1  (via drill 0.35)
  Bottom 0.305: R1.1 42.77,22.52 LED2.C
  other vias: 42.77,22.63
N$2  (via drill 0.35)
  Bottom 0.61: R2.1 44.8,22.54 LED1.C
  other vias: 44.8,22.63
N$3  (via drill 0.35)
  Top 0.61: LED3.C 49.01,22.53 R3.1
  other vias: 48.97,22.49
N$4  (via drill 0.35)
  Top 0.61: LED4.C 46.92,22.53 R4.1
  other vias: 46.89,22.49
N$9  (via drill 0.35)
  Top 0.61: LED9.C 59.44,32.78 R10.1
  other vias: 59.4,32.74
N$10  (via drill 0.35)
  Top 0.61: LED8.C 59.46,28.84 R9.1
  other vias: 59.42,28.88
N$20
  Top 0.61: R5.1 C25.1 26.68,52.08 27.15,52.55 Y1.2
N$36
  Top 0.305: IC1.44 42.85,40.63 41.98,41.5 R8.2
NRST  (via drill 0.35)
  Top 0.305: SL1.5 58.51,40.91 59.69,39.74 59.69,36.43 57.72,34.46 57.72,21.74 S1.1 43.9,17.05 41.72,19.23 v41.72,23.68 | IC1.7 36.8,35.01 C13.1
  Bottom 0.305: C13.1 36.58,35.23 36.58,30.39 37.42,29.55 41.05,29.55 43.12,27.48 43.12,26.08 41.72,24.68 v41.72,23.68
  other vias: 36.44,35.38
OSC_IN  (via drill 0.35)
  Top 0.305: v30.35,45.72 33.98,45.72 35.76,43.94 35.76,38.79 38.54,36.01 IC1.5
  Top 0.61: C26.1 23.73,51.08 22.25,52.55 Y1.1
  Bottom 0.305: v30.35,45.72 29.34,46.74 25.02,46.74 23.73,48.03 C26.1
  other vias: 23.73,48.33
OSC_OUT
  Top 0.305: IC1.6 37.9,35.51 35.05,38.35 35.05,43.69 33.66,45.09 26.69,45.09 R5.2
PB2
  Top 0.305: LED2.A 43.95,25.91 44.2,26.16 44.35,26.31 IC1.20
PB10
  Top 0.305: IC1.21 44.85,24.78 LED1.A
PB11  (via drill 0.35)
  Top 0.305: v47.12,26.42 46.7,26.42 46.05,27.07 C8.1 45.35,28.41 IC1.22
  Bottom 0.305: v47.12,26.42 51.86,26.42 S2.1
  other vias: 53.02,25.25
PB12
  Top 0.305: IC1.25 48.9,31.45 48.9,26.62 LED4.A
PB15
  Top 0.305: LED3.A 49.64,25.29 49.64,27.54 52.01,29.91 52.01,31.18 49.17,34.01 IC1.28
SPI3_MISO  (via drill 0.35)
  Top 0.305: IC1.40 44.85,41.03 44.07,41.8 v43.65,41.8 | Q1.2 20.93,40.82 R11.2 20.93,38.28 21.59,37.62 31.85,37.62 v32.51,36.96
  Bottom 0.305: v32.51,36.96 32.89,36.96 33.66,37.72 33.66,38.48 37.08,41.91 43.55,41.91 v43.65,41.8
  other vias: 20.93,40.75
SPI3_MOSI  (via drill 0.35)
  Top 0.305: v43.61,40.95 43.97,40.95 44.35,40.57 IC1.41 | v24.64,40.82 25.69,39.78 27.05,39.78 28.69,38.14 v34.29,38.14
  Bottom 0.305: v43.61,40.95 43.44,40.77 39.25,40.77 37.12,38.65 34.8,38.65 v34.29,38.14 | R25.2 Q8.2 v24.64,40.82
SPI3_NSS  (via drill 0.35)
  Top 0.305: IC1.38 45.85,41.91 44.23,43.52 v43.65,43.52 | R21.2 Q6.2 30.14,42.59 v32.52,42.59
  Bottom 0.305: v43.65,43.52 43.62,43.49 35.02,43.49 34.12,42.59 v32.52,42.59
  other vias: 28.75,41.17
SPI3_SCK  (via drill 0.35)
  Top 0.305: IC1.39 45.35,41.75 44.43,42.66 v43.65,42.66 | R17.2 16.68,40.96 Q4.2 16.7,38.04 17.78,36.95 v31.32,36.95
  Bottom 0.305: v43.65,42.66 37.03,42.66 32.98,38.6 32.97,38.6 v31.32,36.95
  other vias: 16.64,41.01
SWCLK  (via drill 0.35)
  Top 0.305: IC1.37 46.35,44.38 v46.43,44.45
  Bottom 0.305: SL1.2 57.35,48.12 50.09,48.12 v46.43,44.45
SWDIO  (via drill 0.35)
  Top 0.305: IC1.34 49.08,37.01 50.93,38.86 v50.93,42.02
  Bottom 0.305: v50.93,42.02 51.82,42.91 57.23,42.91 SL1.4
USART3_CTS  (via drill 0.35)
  Top 0.305: v50.29,30.48 49.66,31.11 49.66,32.13 48.78,33.01 IC1.26
  Bottom 0.305: FEP_1.P12 54.43,36.52 52.2,34.29 52.2,32.13 50.55,30.48 v50.29,30.48
USART3_RTS  (via drill 0.35)
  Top 0.305: v51.31,30.33 51.31,31.22 49.02,33.51 IC1.27
  Bottom 0.305: v51.31,30.33 51.79,29.84 52.45,29.84 52.7,30.1 52.7,32.64 54.05,33.98 FEP_1.P13
USART3_RX  (via drill 0.35)
  Top 0.305: IC1.45 42.35,37.78 42.16,37.59 42.16,36.96 42.55,36.58 43.55,36.58 v44.51,37.53 | v49.91,35.31 53.77,31.45 FEP_1.P14
  Bottom 0.305: v44.51,37.53 47.68,37.53 v49.91,35.31
USART3_TX  (via drill 0.35)
  Top 0.305: FEP_1.P15 52.55,30.96 52.55,31.52 49.81,34.26 49.81,34.28 v49.57,34.52 | v44.45,36.2 44.32,36.07 42.41,36.07 41.71,36.77 41.71,37.78 41.85,37.92 IC1.46
  Bottom 0.305: v49.57,34.52 49.29,34.8 49.14,34.8 47.62,36.32 44.58,36.32 v44.45,36.2
USB_DM  (via drill 0.35)
  Top 0.305: v56.26,35.18 51.56,35.18 50.73,36.01 IC1.32
  Bottom 0.305: X9.3 56.64,15.35 56.64,34.8 v56.26,35.18
USB_DP  (via drill 0.35)
  Top 0.305: IC1.33 52.01,36.51 53.21,37.72 56.26,37.72 57.02,36.96 57.02,21.84 53.85,18.67 v53.47,18.67
  Bottom 0.305: v53.47,18.67 47.7,12.9 X9.2

### Text on the board
tPlace: 5V 3V3 | DP0 / DP1 / DP2 / DP3 / DP4 / DP5 / DP6 / DP7 / DP8 / DP9 | 5V / ADC3 / ADC4 / GND | 3V3 / 1_SCL / 1_SDA / GND | User | 5V / ADC5 / ADC6 / GND | 3V3 / 2_SCL / 2_SDA / GND | Reset
bPlace: ADC2 / ADC1 / ADC0 | 5V / GND | 5V / GND | 3V3 / GND | 3V3 / GND | Controller_Keinz_2023 / STM32F302C8T6
tNames: PB12 / PB14 / PB15 / PA8 | Switch